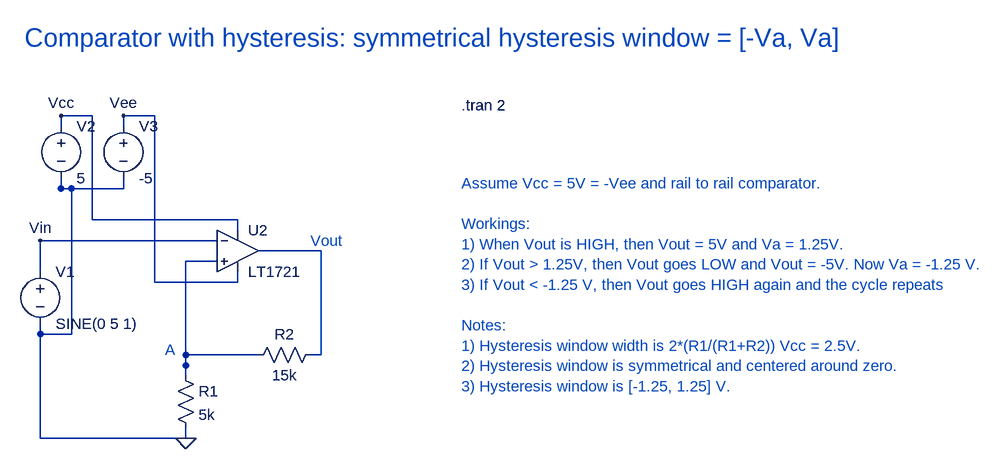
[diagram p0: schematic Comparator-with-hysteresis-symmetrical-window.asc]
Comparator-with-hysteresis-symmetrical-window.asc, the LTspice schematic file:
Version 4.1
SHEET 1 1452 680
WIRE 208 416 208 432
WIRE -16 256 -16 272
WIRE 16 32 16 48
WIRE 112 32 112 48
WIRE 208 432 -16 432
WIRE -16 432 -16 272
WIRE -16 272 32 272
WIRE 32 272 32 48
WIRE 32 48 16 48
WIRE 16 48 112 48
FLAG 208 432 0
WIRE 400 304 416 304
WIRE 320 144 336 144
WIRE 416 304 416 144
WIRE 416 144 336 144
WIRE 208 336 208 320
WIRE 320 304 304 304
WIRE 256 160 240 160
WIRE 208 320 208 304
WIRE 208 304 304 304
WIRE 208 320 208 160
WIRE 208 160 240 160
WIRE 288 112 288 96
WIRE 16 -48 16 -64
WIRE 288 96 64 96
WIRE 64 96 64 -64
WIRE 64 -64 16 -64
FLAG 16 -64 Vcc
WIRE 288 176 288 192
WIRE 112 -48 112 -64
WIRE 288 192 160 192
WIRE 160 192 160 -64
WIRE 160 -64 112 -64
FLAG 112 -64 Vee
WIRE 256 128 240 128
WIRE -16 176 -16 160
WIRE 240 128 -16 128
WIRE -16 128 -16 160
FLAG -16 128 Vin
SYMBOL voltage -16 160 R0
WINDOW 123 0 0 Left 0
WINDOW 39 0 0 Left 0
SYMATTR InstName V1
SYMATTR Value SINE(0 5 1)
SYMBOL voltage 16 -64 R0
WINDOW 123 0 0 Left 0
WINDOW 39 0 0 Left 0
SYMATTR InstName V2
SYMATTR Value 5
SYMBOL res 192 320 R0
SYMATTR InstName R1
SYMATTR Value 5k
SYMBOL res 416 288 R90
WINDOW 0 0 56 VBottom 2
WINDOW 3 32 56 VTop 2
SYMATTR InstName R2
SYMATTR Value 15k
SYMBOL voltage 112 -64 R0
WINDOW 123 0 0 Left 0
WINDOW 39 0 0 Left 0
SYMATTR InstName V3
SYMATTR Value -5
SYMBOL Comparators\\LT1721 288 80 R0
SYMATTR InstName U2
TEXT 632 -80 Left 2 !.tran 2
TEXT -40 -184 Left 4 ;Comparator with hysteresis: symmetrical hysteresis window = [-Va, Va]
TEXT 632 40 Left 2 ;Assume Vcc = 5V = -Vee and rail to rail comparator.\n \nWorkings:\n1) When Vout is HIGH, then Vout = 5V and Va = 1.25V.\n2) If Vout > 1.25V, then Vout goes LOW and Vout = -5V. Now Va = -1.25 V.\n3) If Vout < -1.25 V, then Vout goes HIGH again and the cycle repeats\n \nNotes:\n1) Hysteresis window width is 2*(R1/(R1+R2)) Vcc = 2.5V.\n2) Hysteresis window is symmetrical and centered around zero.\n3) Hysteresis window is [-1.25, 1.25] V.
TEXT 176 296 Left 2 ;A
TEXT 400 128 Left 2 ;Vout

The netlist it stands for:
* Comparator-with-hysteresis-symmetrical-window.asc
V1 Vin 0 SINE(0 5 1)
V2 Vcc 0 5
R1 N002 0 5k
R2 N001 N002 15k
V3 Vee 0 -5
X§U2 N002 Vin Vcc Vee N001 LT1720  ; LT1721, pins In+ In- V+ V- OUT
.tran 2
* Comparator with hysteresis: symmetrical hysteresis window = [-Va, Va]
* Assume Vcc = 5V = -Vee and rail to rail comparator.
* Workings:
* 1) When Vout is HIGH, then Vout = 5V and Va = 1.25V.
* 2) If Vout > 1.25V, then Vout goes LOW and Vout = -5V. Now Va = -1.25 V.
* 3) If Vout < -1.25 V, then Vout goes HIGH again and the cycle repeats
* Notes:
* 1) Hysteresis window width is 2*(R1/(R1+R2)) Vcc = 2.5V.
* 2) Hysteresis window is symmetrical and centered around zero.
* 3) Hysteresis window is [-1.25, 1.25] V.
* A
* Vout
.lib LTC.lib
.backanno
.end